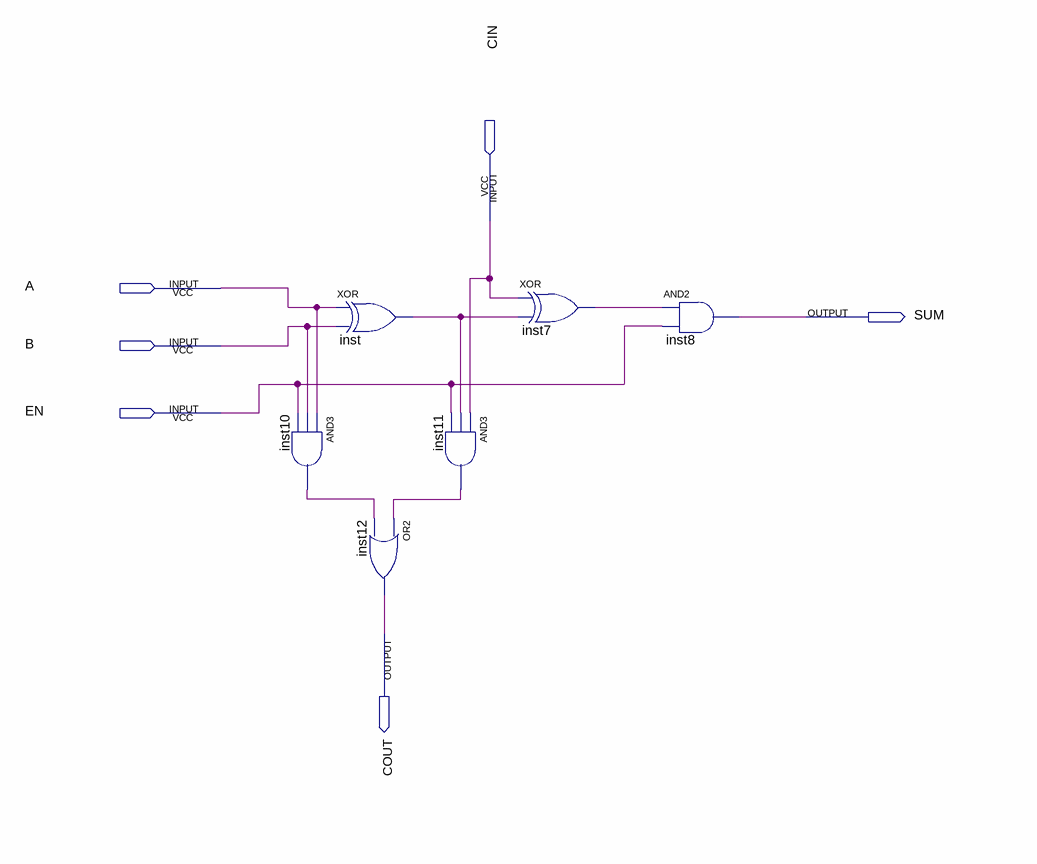
[diagram p0: schematic sheet]
// Quartus schematic full_adder_1bit.bdf as structural Verilog: 6 symbols, 6 pins
module full_adder_1bit (
  input  CIN,
  input  A,
  input  B,
  input  EN,
  output SUM,
  output COUT
);

  wire inst7_out, inst10_out, inst11_out, inst_out;

  and inst10 (inst10_out, A, B, EN);
  xor inst (inst_out, A, B);
  or inst12 (COUT, inst11_out, inst10_out);
  and inst11 (inst11_out, CIN, inst_out, EN);
  xor inst7 (inst7_out, CIN, inst_out);
  and inst8 (SUM, inst7_out, EN);
endmodule
